# EAGLE design googleShoes_rev03 (EAGLE 6.2)
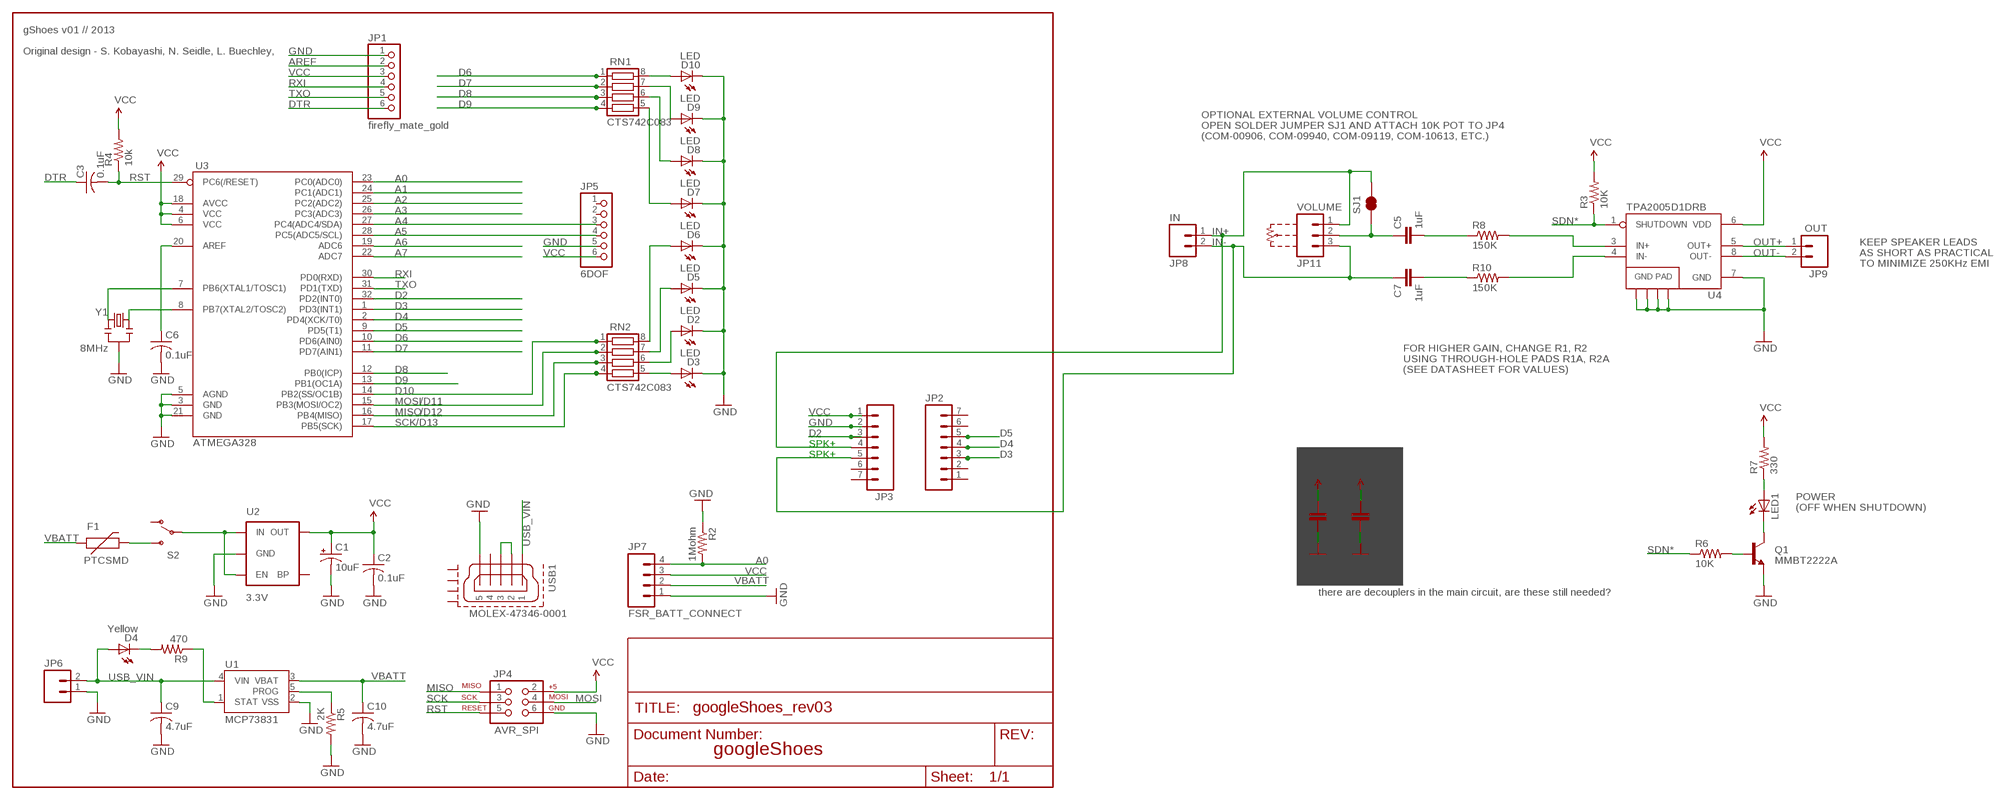
[diagram p0: schematic, sheet 1]

## Parts
C1  10uF  CAP_POL1206  [EIA3216]
C2  0.1uF  C-USC0805  [C0805]
C3  0.1uF  C-USC0805  [C0805]
C4  1uF  CAP1206  [1206]
C5  1uF  CAP1206  [1206]
C6  0.1uF  C-USC0805  [C0805]
C7  1uF  CAP1206  [1206]
C8  10uF  CAP1206  [1206]
C9  4.7uF  C-USC0805  [C0805]
C10  4.7uF  C-USC0805  [C0805]
D2  LED  LEDCHIP-LED0805  [CHIP-LED0805]
D3  LED  LEDCHIP-LED0805  [CHIP-LED0805]
D4  Yellow  LEDCHIP-LED0805  [CHIP-LED0805]
D5  LED  LEDCHIP-LED0805  [CHIP-LED0805]
D6  LED  LEDCHIP-LED0805  [CHIP-LED0805]
D7  LED  LEDCHIP-LED0805  [CHIP-LED0805]
D8  LED  LEDCHIP-LED0805  [CHIP-LED0805]
D9  LED  LEDCHIP-LED0805  [CHIP-LED0805]
D10  LED  LEDCHIP-LED0805  [CHIP-LED0805]
F1  PTCSMD  [PTC-1206]
JP1  firefly_mate_gold  PINHD-1X6B  [1X06-BIG]
JP2  M07  [1X07]
JP3  M07  [1X07]
JP4  AVR_SPI  AVR_SPI_PRG_6PTH  [2X3]
JP5  6DOF  PINHD-1X6B  [1X06-BIG]
JP6  M02PTH  [1X02]
JP7  FSR_BATT_CONNECT  M04PTH  [1X04]
JP8  IN  M02PTH  [1X02]
JP9  OUT  M02PTH  [1X02]
JP11  VOLUME  M03PTH  [1X03]
LED1  LEDCHIPLED_0805  [CHIPLED_0805]
Q1  MMBT2222A  TRANSISTOR_NPNSOT23-3  [SOT23-3]
R2  1Mohm  R-US_M0805  [M0805]
R3  10K  R-US_M0805  [M0805]
R4  10k  R-US_M0805  [M0805]
R5  2K  R-US_M0805  [M0805]
R6  10K  R-US_M0805  [M0805]
R7  330  R-US_M0805  [M0805]
R8  150K  R-US_M0805  [M0805]
R9  470  R-US_M0805  [M0805]
R10  150K  R-US_M0805  [M0805]
RN1  CTS742C083  [CTS742C083]
RN2  CTS742C083  [CTS742C083]
S2  SWITCH-SPSTSMD  [AYZ0202]
SJ1  SOLDERJUMPERNC2  [SJ_2S-NOTRACE]
U1  MCP73831  MCP73831SMD  [SOT23-5]
U2  3.3V  V_REG_LDOSMD  [SOT23-5]
U3  ATMEGA328  ATMEGA168  [TQFP32-08]
U4  TPA2005D1DRB  [QFN-8_PAD]
USB1  MOLEX-47346-0001  [MOLEX-47364-0001]
Y1  8MHz  RESONATORSMD  [RESONATOR-SMD]

## Nets
A0: JP7.4 R2.2 U3.23(PC0(ADC0))
A1: U3.24(PC1(ADC1))
A2: U3.25(PC2(ADC2))
A3: U3.26(PC3(ADC3))
A4: JP5.3 U3.27(PC4(ADC4/SDA))
A5: JP5.4 U3.28(PC5(ADC5/SCL))
A6: U3.19(ADC6)
A7: U3.22(ADC7)
AREF: C6.1 JP1.2 U3.20(AREF)
D2: JP3.3 U3.32(PD2(INT0))
D3: JP2.3 U3.1(PD3(INT1))
D4: JP2.4 U3.2(PD4(XCK/T0))
D5: JP2.5 U3.9(PD5(T1))
D6: RN1.1 U3.10(PD6(AIN0))
D7: RN1.2 U3.11(PD7(AIN1))
D8: RN1.3 U3.12(PB0(ICP))
D9: RN1.4 U3.13(PB1(OC1A))
D10: RN2.1 U3.14(PB2(SS/OC1B))
DTR: C3.1 JP1.6
GND: C1.C(-) C2.2 C4.2 C6.2 C8.2 C9.2 C10.2 D2.C D3.C D5.C D6.C D7.C D8.C D9.C D10.C JP1.1 JP3.2 JP4.6 JP5.5 JP6.1 JP7.1 Q1.2(E) R2.1 R5.2 U1.2(VSS) U2.2(GND) U3.3(GND) U3.5(AGND) U3.21(GND) U4.7(GND) U4.10(GND) U4.11(GND) U4.12(GND) U4.13(GND) USB1.5 Y1.2
IN+: JP3.4 JP8.1 JP11.1 SJ1.2
IN+AMP: R8.2 U4.3(IN+)
IN-: C7.1 JP3.5 JP8.2 JP11.3
IN-AMP: R10.2 U4.4(IN-)
MISO: JP4.1 RN2.3 U3.16(PB4(MISO))
MOSI: JP4.4 RN2.2 U3.15(PB3(MOSI/OC2))
N$1: C5.1 JP11.2 SJ1.1
N$3: D3.A RN2.5
N$4: D2.A RN2.6
N$5: S2.2(P) U2.1(IN) U2.3(EN)
N$6: D5.A RN2.7
N$7: D6.A RN2.8
N$8: D4.C R9.2
N$9: F1.2 S2.3(S)
N$10: U3.7(PB6(XTAL1/TOSC1)) Y1.3
N$11: R5.1 U1.5(PROG)
N$12: U3.8(PB7(XTAL2/TOSC2)) Y1.1
N$13: D10.A RN1.8
N$14: R9.1 U1.1(STAT)
N$15: D9.A RN1.7
N$16: D8.A RN1.6
N$17: D7.A RN1.5
N$18: LED1.A R7.1
N$19: Q1.1(B) R6.2
N$20: LED1.C Q1.3(C)
N$21: C5.2 R8.1
N$22: C7.2 R10.1
N$23: USB1.2 USB1.3
OUT+: JP9.1 U4.5(OUT+)
OUT-: JP9.2 U4.8(OUT-)
RST: C3.2 JP4.5 R4.1 U3.29(PC6(/RESET))
RXI: JP1.4 U3.30(PD0(RXD))
SCK: JP4.3 RN2.4 U3.17(PB5(SCK))
SDN*: R3.1 R6.1 U4.1(SHUTDOWN)
TXO: JP1.5 U3.31(PD1(TXD))
USB_VIN: C9.1 D4.A JP6.2 U1.4(VIN) USB1.1
VBATT: C10.1 F1.1 JP7.2 U1.3(VBAT)
VCC [VCC]: C1.A(+) C2.1 C4.1 C8.1 JP1.3 JP3.1 JP4.2 JP5.6 JP7.3 R3.2 R4.2 R7.2 U2.5(OUT) U3.4(VCC) U3.6(VCC) U3.18(AVCC) U4.6(VDD)
Unconnected: JP2.1 JP2.2 JP2.6 JP2.7 JP3.6 JP3.7 JP5.1 JP5.2 S2.1(O) U2.4(BP) USB1.4 USB1.GND1 USB1.GND2 USB1.GND3 USB1.GND4

## Notes on the sheet
- gShoes v01 // 2013
- Original design - S. Kobayashi, N. Seidle, L. Buechley,
- OPTIONAL EXTERNAL VOLUME CONTROL
- OPEN SOLDER JUMPER SJ1 AND ATTACH 10K POT TO JP4
- (COM-00906, COM-09940, COM-09119, COM-10613, ETC.)
- KEEP SPEAKER LEADS
- AS SHORT AS PRACTICAL
- TO MINIMIZE 250KHz EMI
- FOR HIGHER GAIN, CHANGE R1, R2
- USING THROUGH-HOLE PADS R1A, R2A
- (SEE DATASHEET FOR VALUES)
- /D11
- /D12
- /D13
- SPK+
- SPK+
- POWER
- (OFF WHEN SHUTDOWN)
- there are decouplers in the main circuit, are these still needed?
- googleShoes

## Library data of the parts
C1 = SparkFun:CAP_POL: Capacitor Polarized These are standard SMD and PTH capacitors. Normally 10uF, 47uF, and 100uF in electrolytic and tantalum varieties. Always verify the external diameter of the through hole cap, it varies with capacity, voltage, and manufacturer. The EIA devices should be standard.
C2 C3 C6 C9 C10 = adafruit:C-US: CAPACITOR, American symbol
C4 C5 C7 C8 = SparkFun:CAP: Capacitor Standard 0603 ceramic capacitor, and 0.1" leaded capacitor.
D2-D10 = adafruit:LED: LED
F1 = SparkFun:PTC: Resettable Fuse PTC Resettable Fuse. Spark Fun Electronics SKU : COM-08357
JP1 JP5 = adafruit:PINHD-1X6: PIN HEADER
JP2 JP3 = SparkFun-Connectors:M07: Header 7 Standard 7-pin 0.1" header. Use with straight break away headers (SKU : PRT-00116), right angle break away headers (PRT-00553), swiss pins (PRT-00743), machine pins (PRT-00117), and female headers (PRT-00115). NOTES ON THE VARIANTS LOCK and LOCK_LONGPADS... This footprint was designed to help hold the alignment of a through-hole component (i.e. 7-pin header) while soldering it into place. You may notice that each hole has been shifted either up or down by 0.005 of an inch from it's more standard position (which is usually a perfectly straight line). This slight alteration caused the pins (the squares in the middle) to touch the edges of the holes. Because they are alternating, it causes a "brace" to hold the header in place. 0.005 has proven to be the perfect amount of "off-center" position when using our standard breakaway headers. Although looks a little odd when you look at the bare footprint, once you have a header in there, the alteration is very hard to notice. Also, if you push a header all the way into place, it is covered up entirely on the bottom side. This idea of altering the position of holes to aid alignment will be further integrated into the Sparkfun Library for other footprints. It can help hold any component with 3 or more connection pins.
JP4 = SparkFun:AVR_SPI_PRG_6: AVR ISP 6 Pin This is the reduced ISP connector for AVR programming. Common on Arduino. This footprint will take up less PCB space and can be used with a 10-pin to 6-pin adapter such as SKU: BOB-08508
JP6 JP8 JP9 = SparkFun:M02: Header 2 Standard 2-pin 0.1" header. Use with straight break away headers (SKU : PRT-00116), right angle break away headers (PRT-00553), swiss pins (PRT-00743), machine pins (PRT-00117), and female headers (PRT-00115). Molex polarized connector foot print use with SKU : PRT-08233 with associated crimp pins and housings.
JP7 = SparkFun-Connectors:M04: Header 4 Standard 4-pin 0.1" header. Use with straight break away headers (SKU : PRT-00116), right angle break away headers (PRT-00553), swiss pins (PRT-00743), machine pins (PRT-00117), and female headers (PRT-00115). Molex polarized connector foot print use with SKU : PRT-08231 with associated crimp pins and housings. 1MM SMD Version SKU: PRT-10208
JP11 = SparkFun:M03: Header 3 Standard 3-pin 0.1" header. Use with straight break away headers (SKU : PRT-00116), right angle break away headers (PRT-00553), swiss pins (PRT-00743), machine pins (PRT-00117), and female headers (PRT-00115). Molex polarized connector foot print use with SKU : PRT-08232 with associated crimp pins and housings.
LED1 = led:LED: LED
Q1 = SparkFun:TRANSISTOR_NPN: Transistor NPN BJT configuration in SOT23 package. MMBT2222 is the common NPN we use. Double check BCE configuration again layout.
R2 R4 R5 R9 = rcl:R-US_: RESISTOR, American symbol
R3 R6-R8 R10 = resistor:R-US_: RESISTOR, American symbol
RN1 RN2 = resistor-net:CTS742C083: Chip Resistor Array 4 Single Resistor Source: http://www.ctscorp.com/components/Datasheets/CTSChipArrayDs.pdf; OC_FARNELL: unknown; OC_NEWARK: unknown
S2 = SparkFun:SWITCH-SPST: SPST Switch Simple slide switch. Spark Fun Electronics SKU : COM-00102
SJ1 = SparkFun:SOLDERJUMPER: Solder Jumper Standard SMD solder jumper. Used to automate production. Two varients : Normally Open and Normally Closed are the same, but have different paste layers. NC will have a large amount of paste and should jumper during reflow.
U1 = SparkFun:MCP73831
U2 = SparkFun:V_REG_LDO: Voltage Regulator LDO Standard 150mA LDO voltage regulator in SOT-23 layout. Micrel part MIC5205. BP (by-pass) pin is used to lower output noise with 470pF cap.
U3 = SparkFun:ATMEGA168
U4 = mike-temp:TPA2005D1: 1.4W MONO CLASS-D AUDIO POWER AMPLIFIER The TPA2005D1 is a 1.4-W high efficiency filter-free class-D audio power amplifier in a BGA, QFN, or MSOP package that requires only three external components. Datasheet: http://focus.ti.com/lit/ds/symlink/tpa2005d1.pdf 1.4 W Into 8 ? From a 5V Supply at THD = 10% (Typ) Maximum Battery Life and Minimum Heat Efficiency With an 8-? Speaker: 84% at 400 mW, 79% at 100 mW 2.8-mA Quiescent Current 0.5-mA Shutdown Current Ideal for Wireless or Cellular Handsets and PDAs Capable of Driving an 8-? Speaker (2.5 V ? VDD ? 5.5 V) and a 4-? Speaker (2.5 V ? VDD ? 4.2 V) Only Three External Components Optimized PWM Output Stage Eliminates LC Output Filter Internally Generated 250-kHz Switching Frequency Eliminates Capacitor and Resistor Improved PSRR (-71 dB at 217 Hz) and Wide Supply Voltage (2.5 V to 5.5 V) Eliminates Need for a Voltage Regulator Fully Differential Design Reduces RF Rectification and Eliminates Bypass Capacitor Improved CMRR Eliminates Two Input Coupling Capacitors
USB1 = usb_con-update:MOLEX-47346-0001: MICRO USB B, BOTTOM MOUNT
Y1 = SparkFun:RESONATOR: Resonator Small SMD resonator. This is the itty bitty 10/20MHz resonators with built in caps. CSTCE10M0G55 and CSTCE20M0V53. Footprint has been reviewed closely but hasn't been tested yet.

## Net classes
0 Default: width 0.203 mm
1 VCC: width 0.381 mm
2 LEDPower: width 0.203 mm
3 ButtonSignal: width 0.203 mm

## Board
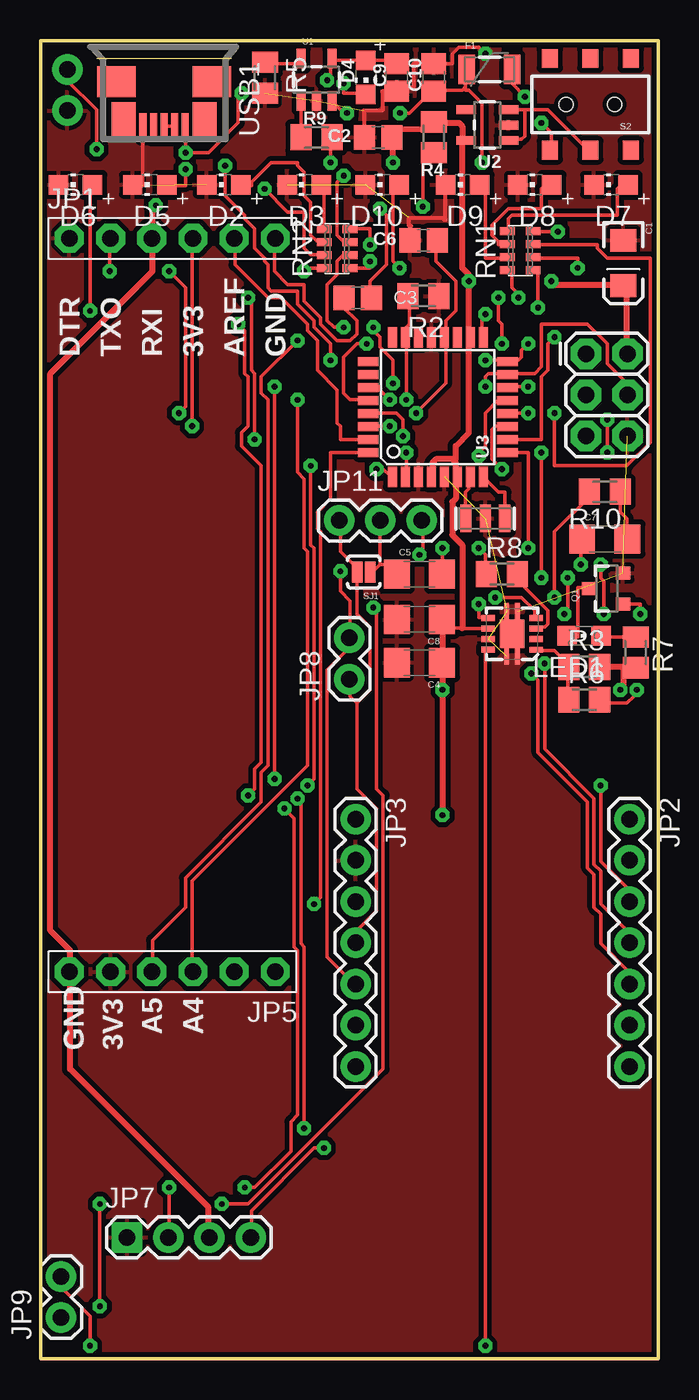
[diagram p1: board, top side]
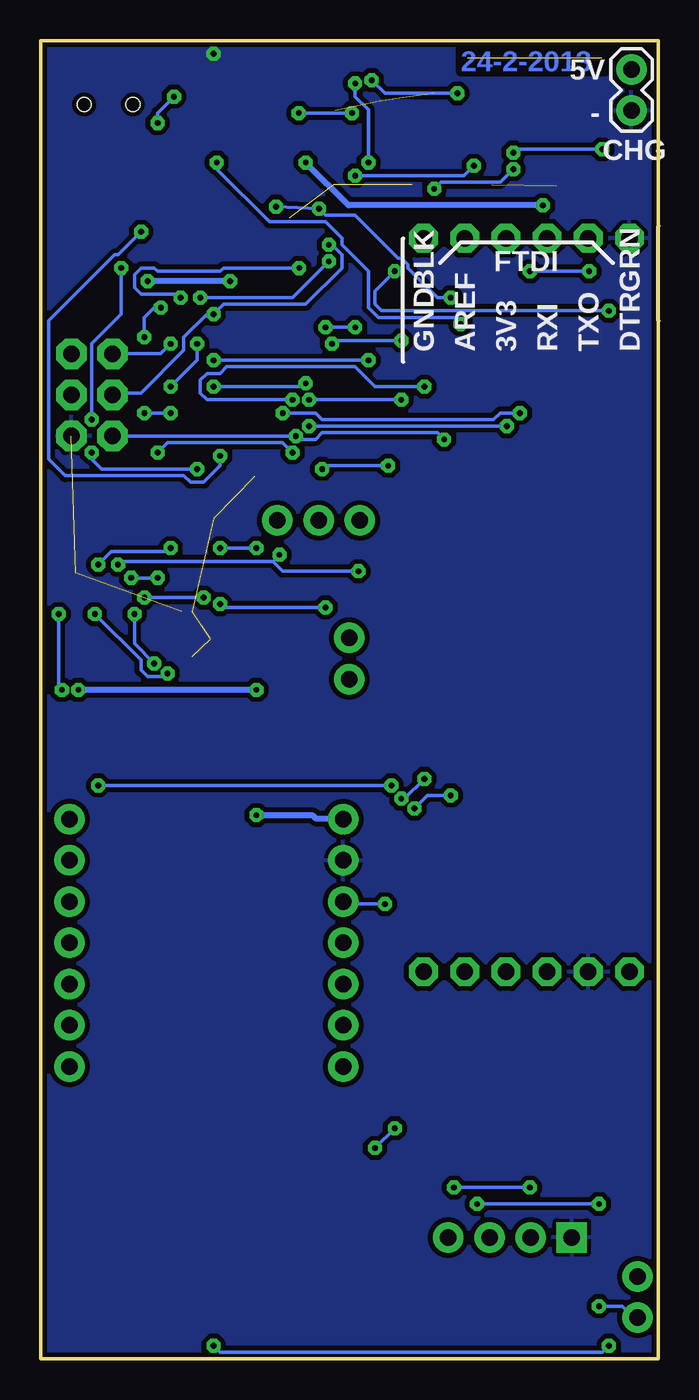
[diagram p2: board, bottom side, seen from below]

Size 38.1 x 81.28 mm. Coordinates in mm from the lower left corner, seen from the top.
Outline: 38.1,0 0,0 0,81.28 38.1,81.28 38.1,0
Copper layers (1*16): Top 0.035mm / dielectric 1.5mm / Bottom 0.035mm
Design rules: minimum track width 8mil, minimum drill 14mil, track to track 8mil, track to pad 8mil, pad to pad 8mil, via to via 4mil, smd to smd 8mil, copper to edge 8mil, drill to drill 8mil, minimum pad ring 12mil, minimum via ring 10mil, stop-mask expansion 4mil, vias tented up to drill 20mil, thermal gap 10mil

### Footprints (pad centres in the part's own frame; a part is rotated, then mirrored left to right if it is on the bottom)
EIA3216 = smd 1.4 x 1.6: A 1.4,0; C -1.4,0
C0805 = smd 1.3 x 1.5: 1 -0.85,0; 2 0.85,0
1206 = smd 1.6 x 1.8: 1 -1.4,0; 2 1.4,0
CHIP-LED0805 = smd 1.2 x 1.2: A 0,-1.05; C 0,1.05
PTC-1206 = smd 1 x 1.8: 1 -1.4,0; 2 1.4,0
1X06-BIG = drill 1.016 pad 1.778 octagon: 1 -6.35,0; 2 -3.81,0; 3 -1.27,0; 4 1.27,0; 5 3.81,0; 6 6.35,0
1X07 = drill 1.016 pad 1.88: 1 0,0; 2 2.54,0; 3 5.08,0; 4 7.62,0; 5 10.16,0; 6 12.7,0; 7 15.24,0
2X3 = drill 1.016 pad 1.88 octagon: 1 0,0; 2 0,2.54; 3 2.54,0; 4 2.54,2.54; 5 5.08,0; 6 5.08,2.54
1X02 = drill 1.016 pad 1.88: 1 0,0; 2 2.54,0
1X04 = drill 1.016 pad 1.88 square: 1 0,0 | drill 1.016 pad 1.88: 2 2.54,0; 3 5.08,0; 4 7.62,0
1X03 = drill 1.016 pad 1.88: 1 0,0; 2 2.54,0; 3 5.08,0
CHIPLED_0805 = smd 1.2 x 1.2: A 0,-1.05; C 0,1.05
SOT23-3 = smd 0.8 x 0.9: 1 -0.95,-1; 2 0.95,-1; 3 0,1.1
M0805 = smd 1.3 x 1.6: 1 -0.95,0; 2 0.95,0
CTS742C083 = smd 0.5 x 0.9: 1 -1.2,-0.8; 2 -0.4,-0.8; 3 0.4,-0.8; 4 1.2,-0.8; 5 1.2,0.8; 6 0.4,0.8; 7 -0.4,0.8; 8 -1.2,0.8
AYZ0202 = smd 1 x 1.15: 1 -2.5,2.825; 2 0,2.825; 3 2.5,2.825; 4 -2.5,-2.825; 5 0,-2.825; 6 2.5,-2.825 | hole 0.85: 1.5,0; -1.5,0
SJ_2S-NOTRACE = smd 0.635 x 1.27: 1 -0.401,0; 2 0.413,0
SOT23-5 = smd 0.55 x 1.2: 1 -0.95,-1.3; 2 0,-1.3; 3 0.95,-1.3; 4 0.95,1.3; 5 -0.95,1.3
TQFP32-08 = smd 1.27 x 0.559: 1 -4.293,2.8; 2 -4.293,2; 3 -4.293,1.2; 4 -4.293,0.4; 5 -4.293,-0.4; 6 -4.293,-1.2; 7 -4.293,-2; 8 -4.293,-2.8; 17 4.293,-2.8; 18 4.293,-2; 19 4.293,-1.2; 20 4.293,-0.4; 21 4.293,0.4; 22 4.293,1.2; 23 4.293,2; 24 4.293,2.8 | smd 0.559 x 1.27: 9 -2.8,-4.293; 10 -2,-4.293; 11 -1.2,-4.293; 12 -0.4,-4.293; 13 0.4,-4.293; 14 1.2,-4.293; 15 2,-4.293; 16 2.8,-4.293; 25 2.8,4.293; 26 2,4.293; 27 1.2,4.293; 28 0.4,4.293; 29 -0.4,4.293; 30 -1.2,4.293; 31 -2,4.293; 32 -2.8,4.293
QFN-8_PAD = smd 0.35 x 0.85: 1 -0.975,-1.475; 2 -0.325,-1.475; 3 0.325,-1.475; 4 0.975,-1.475; 5 0.975,1.475; 6 0.325,1.475; 7 -0.325,1.475; 8 -0.975,1.475 | smd 1.75 x 1.5: 9 0,0 | smd 1.025 x 0.28: 10 -1.387,-0.325; 11 1.387,-0.325; 12 1.387,0.325; 13 -1.387,0.325
MOLEX-47364-0001 = smd 1.7 x 0.45: 1 2.8,1.3; 2 2.8,0.65; 3 2.8,0; 4 2.8,-0.65; 5 2.8,-1.3 | smd 1.9 x 2.375: GND1 0,2.95; GND4 0,-2.95 | smd 2.1 x 1.475: GND2 2.3,2.5; GND3 2.3,-2.5
RESONATOR-SMD = smd 0.7 x 1.7: 1 -1.2,0; 2 0,0; 3 1.2,0

### Placement (x,y rotation side)
C1  35.94,67.56 270 top
C2  20.83,75.31 180 top
C3  19.56,65.41 0 top
C4  23.37,42.93 180 top
C5  23.37,48.39 0 top
C6  23.62,68.96 180 top
C7  34.8,50.55 0 top
C8  23.37,45.59 180 top
C9  21.97,78.99 270 top
C10  24.26,78.99 90 top
D2  11.3,72.39 90 top
D3  16.26,72.39 90 top
D4  20.07,78.99 180 top
D5  6.73,72.39 90 top
D6  2.16,72.39 90 top
D7  35.18,72.39 90 top
D8  30.48,72.39 90 top
D9  26.04,72.39 90 top
D10  21.08,72.39 90 top
F1  27.69,79.5 0 top
JP1  8.13,69.09 0 top
JP2  36.32,33.27 270 top
JP3  19.43,33.27 270 top
JP4  33.66,61.98 270 top
JP5  8.13,23.88 180 top
JP6  1.65,76.96 90 bottom
JP7  5.33,7.49 0 top
JP8  19.05,41.91 90 top
JP9  1.27,2.54 90 top
JP11  18.41,51.69 0 top
LED1  33.53,44.58 90 top
Q1  34.92,47.5 90 top
R2  23.62,65.53 180 top
R3  33.53,42.67 0 top
R4  24.26,75.31 90 top
R5  13.84,78.99 270 top
R6  33.53,40.64 0 top
R7  36.7,43.56 270 top
R8  28.45,48.39 0 top
R9  17.02,75.31 0 top
R10  34.8,53.47 180 top
RN1  29.59,68.33 90 top
RN2  18.29,68.45 90 top
S2  33.91,77.34 180 top
SJ1  19.94,48.51 180 top
U1  17.02,78.87 0 top
U2  27.56,76.07 90 top
U3  24.5,58.68 90 top
U4  29.08,44.7 90 top
USB1  7.62,78.74 270 top
Y1  27.43,51.82 180 top

### Tracks (layer width: path | path; a pad name or v marks a point on that pad's centre or on a via)
A0  (via drill 0.36)
  Top 0.203: R2.2 22.76,65.43 22.76,63.8 22.55,63.6 22.55,62.99 U3.23 22.55,62.79 v22.55,59.13 | v14.43,35.76 v14.43,59.94 | v15.85,34.54 16.05,34.34 16.05,25.6 16.26,25.4 v16.26,14.22 | v17.48,13.01 16.87,13.01 13.01,9.14 13.01,7.52 JP7.4
  Bottom 0.203: v22.55,59.13 27.84,59.13 28.25,59.54 28.25,60.35 27.84,60.76 27.03,60.76 26.62,61.16 18.69,61.16 17.48,59.94 v14.43,59.94 | v14.43,35.76 15.65,34.54 v15.85,34.54 | v17.48,13.01 v16.26,14.22
A4  (via drill 0.36)
  Top 0.203: v21.54,59.13 20.93,59.74 20.93,59.94 20.32,59.94 U3.27 | v15.85,59.13 15.85,54.66 16.26,54.25 16.26,49.99 16.46,49.78 16.46,36.58 9.35,29.46 9.35,23.98 JP5.3
  Bottom 0.203: v15.85,59.13 v21.54,59.13
A5  (via drill 0.36)
  Top 0.203: v15.85,62.79 13.61,60.55 13.61,59.54 14.02,59.13 14.02,36.58 13.61,36.17 13.61,34.34 8.94,29.67 8.94,27.84 6.91,25.81 6.91,23.98 JP5.4 | v20.12,62.59 19.51,62.59 18.69,61.77 18.69,59.54 19.1,59.13 20.12,59.13 U3.28
  Bottom 0.203: v15.85,62.79 19.91,62.79 v20.12,62.59
AREF  (via drill 0.36)
  Top 0.203: C6.1 24.38,68.89 24.38,67.67 25.6,66.45 25.6,64.62 24.99,64.01 24.99,62.99 U3.20 24.99,62.79 24.99,60.15 v23.16,58.32 | v8.53,58.32 8.94,58.73 8.94,66.04 v7.92,67.06 | v4.27,67.06 4.27,69.09 JP1.2
  Bottom 0.203: v23.16,58.32 21.13,58.32 20.73,57.91 10.16,57.91 9.75,58.32 v8.53,58.32 | v4.27,67.06 v7.92,67.06
D2  (via drill 0.36)
  Top 0.203: v16.87,28.04 17.27,28.45 17.27,51 17.07,51.21 17.07,52.22 17.88,53.03 17.88,55.88 20.12,55.88 U3.32
  Bottom 0.203: v16.87,28.04 18.49,28.04 18.69,28.25 19.3,28.25 JP3.3
D3  (via drill 0.36)
  Top 0.203: v20.73,54.86 21.13,54.86 21.54,54.46 U3.1 | v16.66,55.07 16.66,50.19 16.87,49.99 16.87,35.76 v16.46,35.36 | v34.54,35.36 34.54,30.68 36.37,28.85 36.37,28.25 JP2.3
  Bottom 0.203: v20.73,54.86 20.52,55.07 v16.66,55.07 | v34.54,35.36 v16.46,35.36
D4  (via drill 0.36)
  Top 0.203: v22.55,55.88 22.55,54.46 U3.2 | v30.89,48.16 v30.89,55.88 | v32.51,48.16 32.51,46.13 v32.31,45.92 | v31.09,42.88 31.09,37.59 34.14,34.54 34.14,30.48 34.54,30.07 34.54,28.04 36.37,26.21 36.37,25.81 JP2.4
  Bottom 0.203: v22.55,55.88 23.16,56.49 30.28,56.49 v30.89,55.88 | v32.51,48.16 v30.89,48.16 | v32.31,45.92 32.31,44.09 v31.09,42.88
D5  (via drill 0.36)
  Top 0.203: v30.07,49.99 30.07,55.88 28.85,55.88 U3.9 | v34.54,48.97 34.54,48.16 34.75,47.95 v34.75,45.92 | v30.28,42.27 30.68,41.86 30.68,37.39 33.73,34.34 33.73,30.28 34.14,29.87 34.14,27.84 34.54,27.43 34.54,25.6 36.37,23.77 36.37,23.16 JP2.5
  Bottom 0.203: v30.07,49.99 30.28,49.78 33.73,49.78 v34.54,48.97 | v34.75,45.92 31.9,43.08 31.9,42.47 31.5,42.06 30.48,42.06 v30.28,42.27
D6  (via drill 0.36)
  Top 0.203: v31.7,62.99 31.29,62.59 31.29,60.96 30.89,60.55 30.89,56.69 28.85,56.69 U3.10 | v30.68,64.82 30.68,67.06 30.48,67.26 RN1.1
  Bottom 0.203: v31.7,62.99 31.7,64.21 31.09,64.82 v30.68,64.82
D7  (via drill 0.36)
  Top 0.203: v33.12,67.26 33.12,67.87 30.48,67.87 RN1.2 | v34.95,55.88 v34.95,57.91 | v28.45,54.86 27.84,55.47 27.84,57.3 28.04,57.51 28.65,57.51 U3.11
  Bottom 0.203: v33.12,67.26 33.12,64.41 34.95,62.59 v34.95,57.91 | v34.95,55.88 34.95,55.47 34.34,54.86 v28.45,54.86
D8  (via drill 0.36)
  Top 0.203: v31.7,58.32 31.7,55.07 36.17,55.07 37.59,56.49 37.59,67.87 34.95,67.87 34.34,68.48 34.34,68.68 30.48,68.68 RN1.3 | v30.07,58.32 28.85,58.32 U3.12
  Bottom 0.203: v30.07,58.32 v31.7,58.32
D9  (via drill 0.36)
  Top 0.203: v31.9,69.49 30.48,69.49 RN1.4 | v27.03,55.68 27.03,55.88 27.43,56.29 27.43,58.32 28.25,59.13 28.65,59.13 U3.13
  Bottom 0.203: v31.9,69.49 33.33,68.07 33.53,68.07 37.59,64.01 37.59,55.47 36.58,54.46 29.26,54.46 28.85,54.05 28.04,54.05 27.03,55.07 v27.03,55.68
D10  (via drill 0.36)
  Top 0.203: v20.32,67.67 20.32,67.26 RN2.1 | v28.25,65.43 28.25,64.01 28.45,63.8 v28.45,62.59 | v30.07,59.94 28.85,59.94 U3.14
  Bottom 0.203: v20.32,67.67 22.55,65.43 v28.25,65.43 | v28.45,62.59 28.45,61.57 v30.07,59.94
DTR
  Top 0.203: JP1.6 14.43,69.09 14.43,67.06 15.24,66.24 16.26,66.24 16.26,65.23 17.27,64.21 17.27,63.8 18.29,62.79 19.1,62.79 19.51,63.2 19.51,64.01 18.69,64.82 18.69,65.23 C3.1
GND  (via drill 0.36)  (11 unrouted)
  Top 0.203: v27.43,80.47 27.03,80.87 25.81,80.87 25.4,80.47 25.4,79.86 24.38,79.86 C10.2 | USB1.5 6.3,75.79 6.3,72.34 5.69,72.34 D5.C
  Top 0.254: C6.2 22.86,68.96 22.86,69.85 22.73,69.85 22.73,70.36 24.89,70.36 24.89,70.23 24.98,70.23 D9.C | C10.2 22.99,79.84 22.99,78.36 21.97,78.36 C9.2 21.08,78.14 21.08,76.96 19.94,76.96 19.94,75.31
  pour Top (isolate 0.305): 0,81.28 38.1,81.28 38.1,0 0,0
  pour Bottom (isolate 0.305): 0,81.28 38.1,81.28 38.1,0 0,0
IN+
  Top 0.203: 19.51,40.44 20.32,41.25 20.32,45.11 19.51,45.92 19.51,48.36 SJ1.2 19.51,48.56 19.51,48.77 18.49,49.78 18.49,51.61 JP11.1 | 19.51,40.44 19.51,35.15 20.73,33.93 20.73,27.64 19.51,26.42 19.51,25.81 JP3.4 | 19.51,40.44 19.1,40.84 19.1,41.86 JP8.1
IN+AMP
  Top 0.203: U4.3 30.68,45.11 31.09,45.11 31.29,45.31 31.29,46.13 29.46,47.95 29.46,48.36 R8.2
IN-  (via drill 0.36)
  Top 0.203: v33.33,48.97 33.33,50.39 C7.1 | v23.37,49.58 23.57,49.78 23.57,51.61 JP11.3 | JP3.5 19.3,23.16 17.68,24.79 17.68,42.47 19.1,43.89 19.1,44.3 JP8.2 19.1,44.5 19.1,46.74 18.49,47.35 v18.49,48.56
  Bottom 0.203: v33.33,48.97 33.12,49.17 23.77,49.17 | v23.37,49.58 23.77,49.17 | 23.77,49.17 23.16,48.56 v18.49,48.56
IN-AMP  (via drill 0.36)
  Top 0.203: v28.04,46.94 29.67,46.94 30.48,46.13 30.48,45.72 U4.4 | v31.7,46.94 31.7,51 33.93,53.24 33.93,53.44 R10.2
  Bottom 0.203: v31.7,46.94 v28.04,46.94
MISO  (via drill 0.36)
  Top 0.203: v30.07,62.59 29.67,62.18 29.67,61.77 29.46,61.57 28.85,61.57 U3.16 28.65,61.57 v27.43,61.57 | v18.69,72.95 18.29,72.54 18.29,69.29 18.69,68.89 18.9,68.89 RN2.3 | v11.38,73.56 11.38,71.73 12.6,70.51 12.6,70.31 13.21,69.7 13.21,68.48 13.82,67.87 13.82,67.67 14.02,67.46 14.02,66.04 14.22,65.84 15.85,65.84 15.85,65.02 16.87,64.01 16.87,63.6 17.88,62.59 v17.88,61.57
  Bottom 0.203: JP4.1 30.68,61.98 v30.07,62.59 | v18.69,72.95 11.99,72.95 v11.38,73.56 | v27.43,61.57 v17.88,61.57
MOSI  (via drill 0.36)
  Top 0.203: JP4.4 36.17,59.54 36.17,60.15 34.95,61.37 34.95,62.59 33.73,63.8 30.89,63.8 30.89,61.16 30.48,60.76 28.85,60.76 U3.15 28.65,60.76 27.64,60.76 27.43,60.55 v27.43,59.94 | v18.69,63.6 18.09,63.6 17.68,64.01 17.68,66.24 18.29,66.85 18.29,67.67 18.69,68.07 18.9,68.07 RN2.2 | v20.52,63.6 20.52,63.4 20.93,62.99 20.93,62.38 21.74,61.57 v21.74,60.15
  Bottom 0.203: v20.52,63.6 v18.69,63.6 | v21.74,60.15 21.95,59.94 v27.43,59.94
N$1
  Top 0.203: 20.93,48.97 20.52,48.56 SJ1.1 | 20.93,48.97 20.93,51.61 JP11.2 | 20.93,48.97 21.54,48.97 21.95,48.56 C5.1
N$3
  Top 0.203: RN2.5 17.48,69.7 17.48,72.34 D3.A
N$4
  Top 0.203: D2.A 12.39,72.34 13.01,72.34 13.01,72.54 14.22,73.76 15.85,73.76 15.85,73.56 16.26,73.15 16.26,71.73 16.66,71.32 16.66,69.29 17.07,68.89 17.48,68.89 RN2.6
N$5
  Top 0.203: 29.87,77.01 29.06,77.01 U2.3 | 29.87,77.01 29.87,75.39 29.67,75.18 29.06,75.18 U2.1 | 29.87,77.01 31.29,77.01 33.73,74.57 S2.2
N$6  (via drill 0.36)
  Top 0.203: v8.94,73.36 8.94,72.34 7.92,72.34 D5.A | v13.82,72.14 15.24,70.71 16.26,70.71 16.26,68.48 16.66,68.07 17.48,68.07 RN2.7
  Bottom 0.203: v8.94,73.36 9.75,72.54 13.41,72.54 v13.82,72.14
N$7  (via drill 0.36)
  Top 0.203: v16.26,67.06 16.26,67.26 17.48,67.26 RN2.8 | v3.05,64.62 3.05,72.34 D6.A
  Bottom 0.203: v16.26,67.06 17.48,65.84 17.48,65.02 17.07,64.62 v3.05,64.62
N$8  (via drill 0.36)
  Top 0.203: v18.69,78.64 18.69,78.03 19.91,78.03 D4.C | v17.88,73.76 17.88,75.18 R9.2
  Bottom 0.203: v18.69,78.64 18.69,77.83 17.88,77.01 v17.88,73.76
N$9  (via drill 0.36)
  Top 0.203: v30.89,76.2 31.5,75.59 31.5,74.57 S2.3 | v29.87,77.83 29.06,78.64 29.06,79.45 F1.2
  Bottom 0.203: v30.89,76.2 30.89,76.81 v29.87,77.83
N$10
  Top 0.203: U3.7 26.42,54.25 26.42,53.65 26.21,53.44 26.21,51.82 Y1.3
N$11
  Top 0.203: U1.5 16.05,80.06 15.85,79.86 14.02,79.86 R5.1
N$12
  Top 0.203: U3.8 27.43,54.25 28.25,53.44 28.65,53.44 28.65,51.82 Y1.1
N$13  (via drill 0.36)
  Top 0.203: v29.46,65.43 29.46,65.63 29.06,66.04 29.06,66.85 28.85,67.06 RN1.8 | v22.15,67.26 21.74,67.67 21.74,72.34 21.95,72.54 D10.A
  Bottom 0.203: v29.46,65.43 29.67,65.63 31.9,65.63 32.31,66.04 32.31,66.85 31.9,67.26 31.09,67.26 30.89,67.06 27.03,67.06 26.82,67.26 v22.15,67.26
N$14
  Top 0.203: U1.1 16.05,77.42 16.05,75.39 R9.1
N$15
  Top 0.203: RN1.7 28.65,67.87 27.43,67.87 27.43,72.34 27.23,72.54 D9.A
N$16
  Top 0.203: RN1.6 28.65,68.68 28.25,68.68 28.25,68.89 27.84,69.29 27.84,69.9 28.85,70.92 30.89,70.92 30.89,72.14 31.09,72.34 31.5,72.34 D8.A
N$17
  Top 0.203: RN1.5 28.85,69.7 28.85,70.31 29.06,70.51 35.56,70.51 35.56,72.14 35.76,72.34 36.17,72.34 D7.A
N$18
  Top 0.203: LED1.A 34.75,44.5 36.58,44.5 R7.1
N$19  (via drill 0.36)
  Top 0.203: v36.98,45.92 36.98,46.53 35.97,46.53 Q1.1 | v36.78,41.25 36.58,41.05 36.58,40.84 36.17,40.44 34.54,40.44 34.54,40.64 R6.2
  Bottom 0.203: v36.98,45.92 36.98,41.45 v36.78,41.25
N$20
  Top 0.203: Q1.3 33.73,47.55 33.12,47.55 33.12,44.5 32.51,44.5 LED1.C
N$21  (via drill 0.36)
  Top 0.203: v27.03,49.99 27.43,49.58 27.43,48.56 R8.1 | v24.79,49.99 24.79,48.56 C5.2
  Bottom 0.203: v24.79,49.99 v27.03,49.99
N$22
  Top 0.203: R10.1 35.76,53.44 35.76,52.22 36.17,51.82 36.17,50.6 C7.2
N$23
  Top 0.203: USB1.2 8.13,76 7.72,76 USB1.3
OUT+  (via drill 0.36)
  Top 0.203: v27.03,46.53 27.03,45.72 27.43,45.72 U4.5 | v20.52,46.33 20.73,46.13 20.73,35.15 21.13,34.75 21.13,17.88 12.8,9.55 v11.18,9.55 | v3.66,3.25 v3.66,9.55
  Bottom 0.203: v27.03,46.53 26.82,46.33 v20.52,46.33 | v3.66,9.55 v11.18,9.55 | v3.66,3.25 2.23,3.25 1.63,2.64 1.42,2.64 JP9.1
OUT-  (via drill 0.36)
  Top 0.203: v27.43,0.81 27.43,43.69 U4.8 | v3.05,0.81 3.05,2.64 1.22,4.47 1.22,5.08 JP9.2
  Bottom 0.203: v27.43,0.81 27.03,0.41 3.45,0.41 v3.05,0.81
RST  (via drill 0.36)
  Top 0.203: v20.93,70.92 21.34,70.51 21.34,67.46 20.32,66.45 20.32,65.43 C3.2 | v23.57,71.04 23.57,74.37 24.18,74.37 R4.1 | v22.35,56.9 22.35,57.91 21.95,58.32 20.32,58.32 U3.29 | v12.8,65.43 13.01,65.23 13.01,60.96 13.21,60.76 v13.21,56.69
  Bottom 0.203: v23.57,71.04 v20.93,70.92 20.52,70.51 18.69,70.51 16.05,67.87 15.85,67.87 15.44,67.46 15.44,67.26 13.61,65.43 v12.8,65.43 | JP4.5 v22.35,56.9 22.15,56.69 21.13,56.69 20.73,57.1 13.61,57.1 v13.21,56.69
RXI  (via drill 0.36)
  Top 0.203: v21.54,57.51 20.32,57.51 U3.30 | v9.35,57.51 9.35,69.09 JP1.4
  Bottom 0.203: v9.35,57.51 v21.54,57.51
SCK  (via drill 0.36)
  Top 0.203: v27.43,64.41 27.23,64.21 27.23,62.99 U3.17 | v20.32,68.68 20.32,69.7 19.1,69.7 RN2.4
  Bottom 0.203: JP4.3 33.53,59.54 31.9,59.54 29.26,62.18 29.26,62.99 27.84,64.41 v27.43,64.41 26.82,65.02 21.74,65.02 19.51,67.26 19.51,68.07 19.91,68.48 20.12,68.48 v20.32,68.68
SDN*
  Top 0.203: 32.51,42.67 32.51,40.64 R6.1 | 32.51,42.67 32.51,42.88 31.7,43.69 30.68,43.69 U4.1 | 32.51,42.67 R3.1
TXO
  Top 0.203: U3.31 20.12,56.69 18.49,56.69 18.49,57.51 18.29,57.71 18.29,59.74 17.07,60.96 17.07,62.79 16.46,63.4 16.46,63.8 14.83,65.43 14.02,65.43 11.99,67.46 11.99,69.09 JP1.5
USB_VIN  (via drill 0.36)
  Top 0.203: C9.1 22.15,79.86 21.74,79.86 21.54,80.06 20.12,80.06 D4.A 19.91,80.06 18.09,80.06 U1.4 17.88,80.06 17.88,79.05 v17.68,78.84 | v3.45,74.57 3.45,77.01 1.63,78.84 1.63,79.45 JP6.2 | USB1.1 8.94,75.79 v8.94,74.37 10.36,74.37 12.19,76.2 12.19,77.83 v12.39,78.03
  Bottom 0.203: v8.94,74.37 8.74,74.57 v3.45,74.57 | v17.68,78.84 16.87,78.03 v12.39,78.03
VBATT  (via drill 0.36)
  Top 0.203: v18.9,76.81 18.69,77.01 18.49,77.01 18.09,77.42 U1.3 | v22.17,76.81 22.76,76.81 23.77,77.83 23.77,78.03 23.98,78.23 24.18,78.23 C10.1 24.38,78.23 26.01,78.23 26.21,78.44 | 26.21,78.44 26.21,79.45 F1.1 | v7.92,10.57 7.92,7.52 JP7.2 | v12.6,10.57 13.21,10.57 15.44,12.8 15.44,14.63 15.85,15.04 15.85,25.2 15.65,25.4 15.65,33.33 v15.04,33.93 | v12.8,34.75 13.21,35.15 13.21,36.37 13.61,36.78 13.61,55.07 12.39,56.29 12.39,57.1 12.8,57.51 12.8,60.55 12.6,60.76 12.6,63.4 v12.19,63.8 | v27.23,73.76 27.23,77.42 26.42,78.23 26.21,78.23 26.21,78.44
  Bottom 0.203: v22.17,76.81 v18.9,76.81 | v12.6,10.57 v7.92,10.57 | v15.04,33.93 14.22,34.75 v12.8,34.75 | v12.19,63.8 12.6,64.21 17.27,64.21 17.88,64.82 17.88,67.06 19.51,68.68 19.51,69.09 20.52,70.1 23.98,70.1 27.23,73.36 v27.23,73.76
VCC  (via drill 0.36)
  Top 0.254: C8.1 24.69,45.09 26.01,45.06 U4.6
  Top 0.381: JP4.2 36.17,61.98 36.17,66.24 35.97,66.24 C1.A 35.76,66.24 31.7,66.24 v31.5,66.45 | 26.01,75.18 26.21,75.18 U2.5 26.01,75.18 | 26.01,75.18 26.01,76 25.81,76.2 24.38,76.2 R4.2 24.18,76.2 24.05,75.82 21.74,75.79 21.74,75.39 C2.1 21.74,75.18 v21.74,73.76 | 35.97,42.67 36.58,42.67 R7.2 35.97,42.67 | 35.97,42.67 R3.2 | C8.1 24.79,45.11 24.79,43.08 C4.1 24.79,42.88 v24.79,41.25 v24.79,33.53 | 25.5,55.37 25.6,55.27 25.6,54.46 U3.6 25.6,54.25 25.6,53.03 25.4,52.83 25.4,50.8 26.01,50.19 26.01,45.11 26.01,45.06 | 25.5,55.37 25.4,55.47 24.38,55.47 24.18,55.27 24.18,54.46 U3.4 | 25.5,55.37 25.6,55.47 25.6,56.29 26.42,57.1 26.42,62.79 U3.18 26.42,62.99 v26.42,66.45 26.42,66.85 26.01,67.26 26.01,75.18 | 35.97,42.67 35.97,41.45 v35.76,41.25 | JP7.3 10.36,7.52 10.36,9.35 1.83,17.88 1.83,23.77 JP5.6 1.83,23.98 1.83,25.2 0.61,26.42 0.61,60.76 6.91,67.06 6.91,69.09 | v7.11,71.12 6.91,70.92 6.91,69.09 | 6.91,69.09 JP1.3
  Bottom 0.381: v24.79,41.25 v35.76,41.25 | v24.79,33.53 21.34,33.53 21.13,33.33 19.51,33.33 JP3.1 | v26.42,66.45 v31.5,66.45 | v21.74,73.76 19.1,71.12 v7.11,71.12

### Text on the board
Bottom: 24-2-2013
tPlace: googleShoes | v01 | D2 | D3* | A0 | DTR | TXO | RXI | 3V3 | AREF | GND | ON | CHG | A5 | A4 | GND | 3V3
bPlace: 5V | BAT | - | CHG | FTDI | GRN | BLK | DTR | TXO | RXI | 3V3 | AREF | GND | - | +
_bsilk: 6DOF